# EAGLE design midihub (EAGLE 5.10)
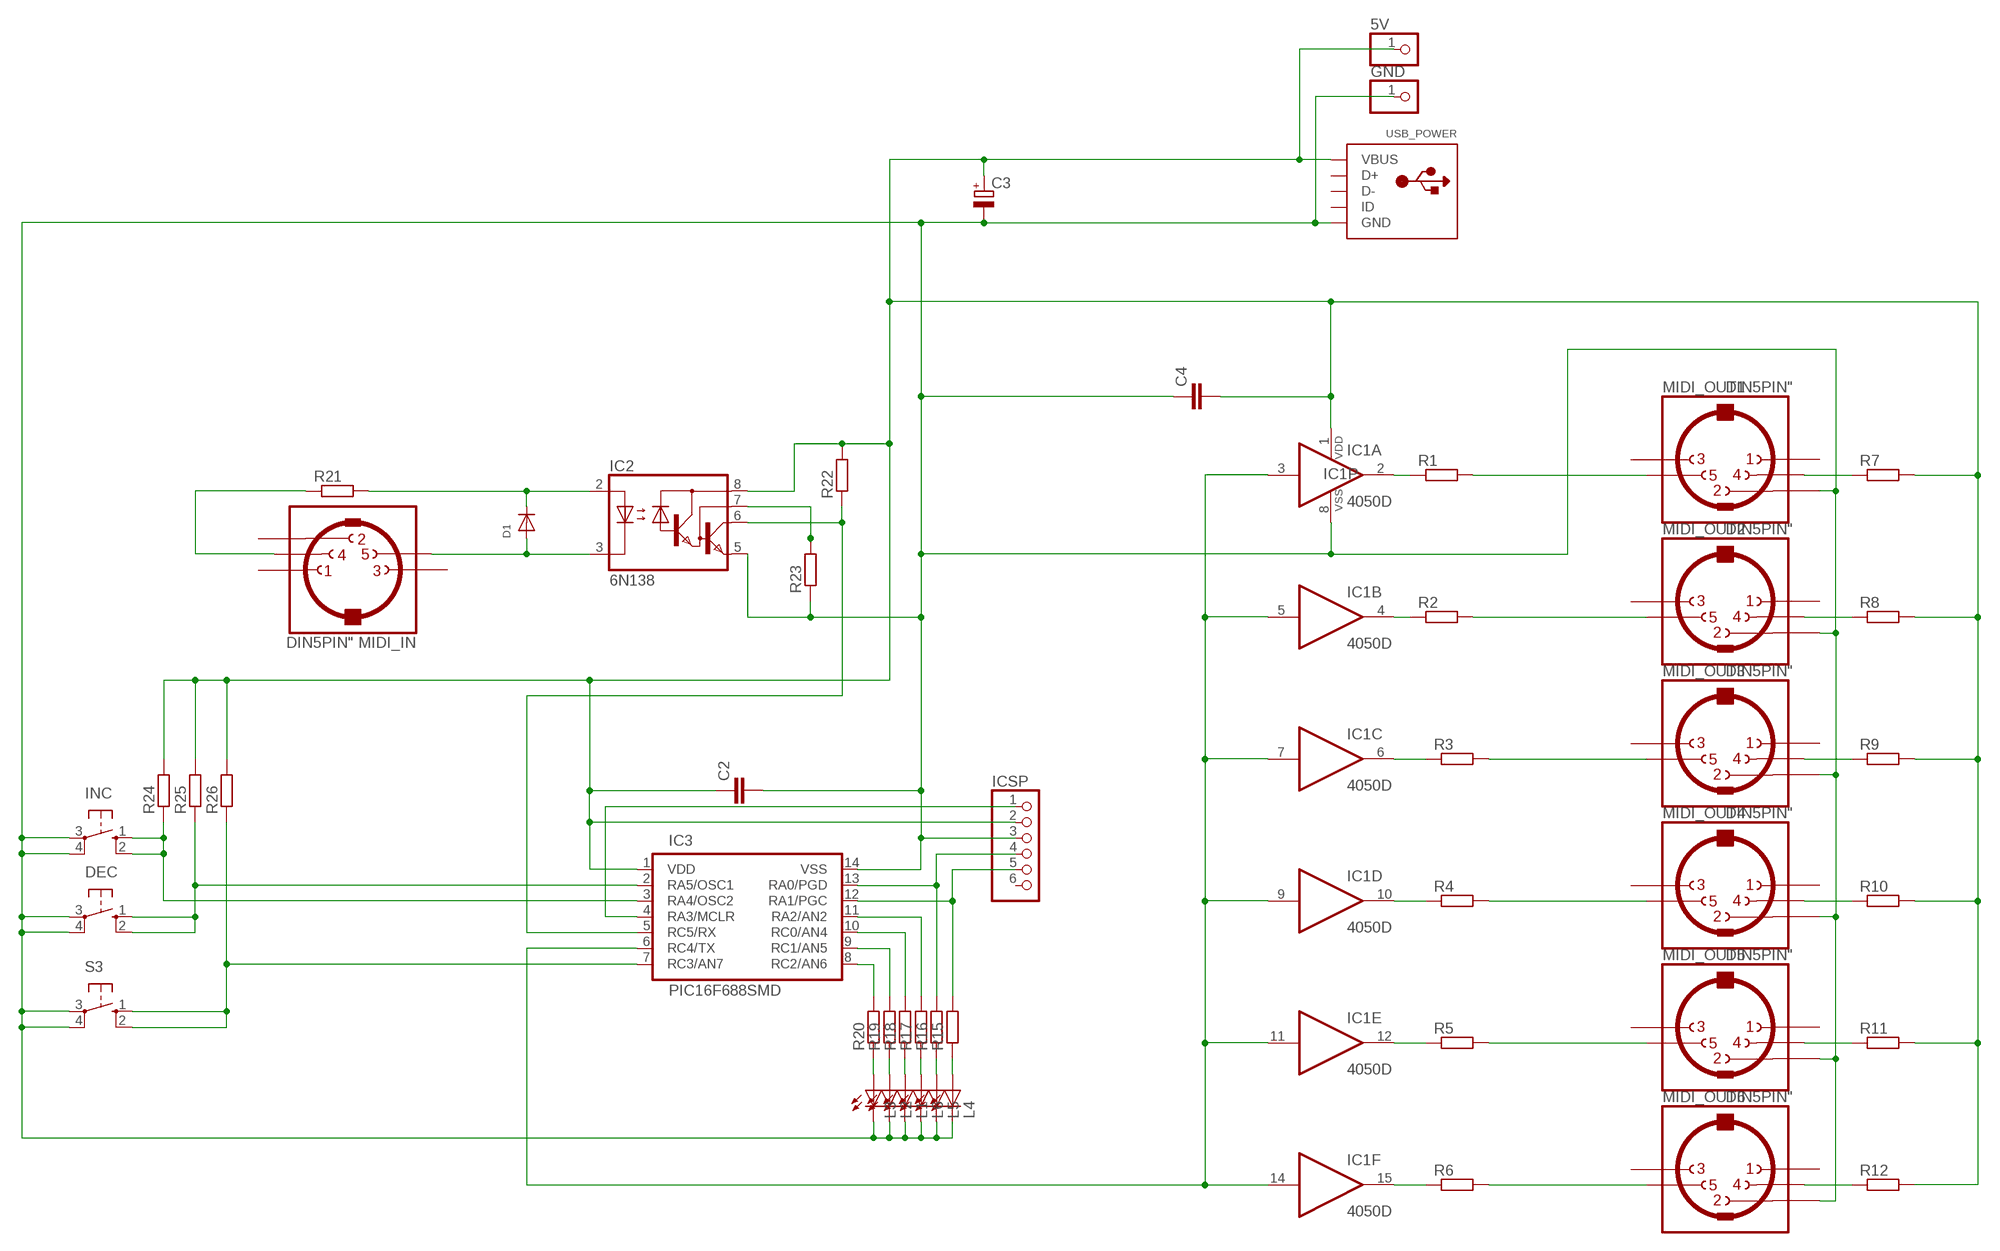
[diagram p0: schematic, sheet 1]

## Parts
5V  PINHD-1X1  [1X01]
C2  C-EUC0805  [C0805]
C3  CPOL-EUSMCB  [SMC_B]
C4  C-EUC0805  [C0805]
D1  DIODESOD-123  [SOD-123]
DEC  40-XX  [B3F-40XX-NOTAB]
GND  PINHD-1X1  [1X01]
IC1  4050D  [SO16]
IC2  6N138  [DIL08]
IC3  PIC16F688SMD  [SOIC-14]
ICSP  PINHD-1X6  [1X06]
INC  40-XX  [B3F-40XX-NOTAB]
L1  LED3MM  [LED3MM]
L2  LED3MM  [LED3MM]
L3  LED3MM  [LED3MM]
L4  LED3MM  [LED3MM]
L5  LED3MM  [LED3MM]
L6  LED3MM  [LED3MM]
MIDI_IN  DIN5PIN"  [TRUCONN90]
MIDI_OUT1  DIN5PIN"  [TRUCONN90]
MIDI_OUT2  DIN5PIN"  [TRUCONN90]
MIDI_OUT3  DIN5PIN"  [TRUCONN90]
MIDI_OUT4  DIN5PIN"  [TRUCONN90]
MIDI_OUT5  DIN5PIN"  [TRUCONN90]
MIDI_OUT6  DIN5PIN"  [TRUCONN90]
R1  R-EU_R0805  [R0805]
R2  R-EU_R0805  [R0805]
R3  R-EU_R0805  [R0805]
R4  R-EU_R0805  [R0805]
R5  R-EU_R0805  [R0805]
R6  R-EU_R0805  [R0805]
R7  R-EU_R0805  [R0805]
R8  R-EU_R0805  [R0805]
R9  R-EU_R0805  [R0805]
R10  R-EU_R0805  [R0805]
R11  R-EU_R0805  [R0805]
R12  R-EU_R0805  [R0805]
R15  R-EU_R0805  [R0805]
R16  R-EU_R0805  [R0805]
R17  R-EU_R0805  [R0805]
R18  R-EU_R0805  [R0805]
R19  R-EU_R0805  [R0805]
R20  R-EU_R0805  [R0805]
R21  R-EU_R0805  [R0805]
R22  R-EU_R0805  [R0805]
R23  R-EU_R0805  [R0805]
R24  R-EU_R0805  [R0805]
R25  R-EU_R0805  [R0805]
R26  R-EU_R0805  [R0805]
S3  40-XX  [B3F-40XX-NOTAB]
USB_POWER  USBTHM  [USB-MINIB-THM]

## Nets
GND: C2.2 C3.- C4.1 DEC.3(P) DEC.4(P1) GND.1 IC1.8(P:VSS) IC2.5(GND) IC3.14(VSS) ICSP.3 INC.3(P) INC.4(P1) L1.K(C) L2.K(C) L3.K(C) L4.K(C) L5.K(C) L6.K(C) MIDI_OUT1.2 MIDI_OUT2.2 MIDI_OUT3.2 MIDI_OUT4.2 MIDI_OUT5.2 MIDI_OUT6.2 R23.1 S3.3(P) S3.4(P1) USB_POWER.GND
N$1: IC1.2(A:O) R1.1
N$2: IC1.4(B:O) R2.1
N$3: IC1.6(C:O) R3.1
N$4: IC1.10(D:O) R4.1
N$5: IC1.12(E:O) R5.1
N$6: IC1.15(F:O) R6.1
N$7: MIDI_OUT1.5 R1.2
N$8: MIDI_OUT2.5 R2.2
N$9: MIDI_OUT3.5 R3.2
N$10: MIDI_OUT4.5 R4.2
N$11: MIDI_OUT5.5 R5.2
N$12: MIDI_OUT6.5 R6.2
N$13: MIDI_OUT1.4 R7.1
N$14: MIDI_OUT2.4 R8.1
N$15: MIDI_OUT3.4 R9.1
N$16: MIDI_OUT4.4 R10.1
N$17: MIDI_OUT5.4 R11.1
N$18: MIDI_OUT6.4 R12.1
N$19: IC3.13(RA0/PGD) ICSP.4 R16.2
N$20: IC3.3(RA4/OSC2) INC.1(S) INC.2(S1) R24.1
N$21: DEC.1(S) DEC.2(S1) IC3.2(RA5/OSC1) R25.1
N$22: L3.A R20.1
N$23: L2.A R19.1
N$24: L1.A R18.1
N$25: L6.A R17.1
N$26: L5.A R16.1
N$27: L4.A R15.1
N$28: IC3.8(RC2/AN6) R20.2
N$29: IC3.9(RC1/AN5) R19.2
N$30: IC3.10(RC0/AN4) R18.2
N$31: IC3.11(RA2/AN2) R17.2
N$32: IC3.7(RC3/AN7) R26.1 S3.1(S) S3.2(S1)
N$36: IC1.3(A:I) IC1.5(B:I) IC1.7(C:I) IC1.9(D:I) IC1.11(E:I) IC1.14(F:I) IC3.6(RC4/TX)
N$38: IC3.12(RA1/PGC) ICSP.5 R15.2
N$41: D1.A IC2.3(C) MIDI_IN.5
N$42: MIDI_IN.4 R21.1
N$43: D1.C IC2.2(A) R21.2
N$44: IC3.4(RA3/MCLR) ICSP.1
N$45: IC2.6(VO) IC3.5(RC5/RX) R22.1
N$46: IC2.7(VB) R23.2
VDD: 5V.1 C2.1 C3.+ C4.2 IC1.1(P:VDD) IC2.8(VCC) IC3.1(VDD) ICSP.2 R7.2 R8.2 R9.2 R10.2 R11.2 R12.2 R22.2 R24.2 R25.2 R26.2 USB_POWER.VBUS
Unconnected: ICSP.6 MIDI_IN.1 MIDI_IN.2 MIDI_IN.3 MIDI_OUT1.1 MIDI_OUT1.3 MIDI_OUT2.1 MIDI_OUT2.3 MIDI_OUT3.1 MIDI_OUT3.3 MIDI_OUT4.1 MIDI_OUT4.3 MIDI_OUT5.1 MIDI_OUT5.3 MIDI_OUT6.1 MIDI_OUT6.3 USB_POWER.D+ USB_POWER.D- USB_POWER.ID

## Library data of the parts
5V GND = pinhead:PINHD-1X1: PIN HEADER
C2 C4 = rcl:C-EU: CAPACITOR, European symbol
C3 = rcl:CPOL-EU: POLARIZED CAPACITOR, European symbol
D1 = adafruit:DIODE: Diode SMADIODE - SMA Surface Mount Package 20V 1A Schottky Diode Digikey: 641-1014-6-ND DO-1N4148 - Through Hole Small Current Diode SOD-123 20V 1 A (.5mV Vf) Schottky Diode - Digikey: MBRX120TPMSCT-ND SOD-323 10V 570mA (.38mV Vf, 3ns) Schottky Diode - Digikey: ZLLS410CT-ND SOD-523 30V 30mA Schottky Diode (RB751S-40TE61) - Digikey: RB751S-40TE61CT-ND SOT23-R/W - SOT23 Package (R = Solder Paste/Reflow Ovens, W = Hand-Soldering) BAT54Film 40V 300mA - Digikey: 497-7162-1-ND
DEC INC S3 = jasons_stuff:40-XX: OMRON SWITCH
IC1 = 40xx:4050: Hex non-inverting BUFFER
IC2 = optocoupler:6N138: MOTOROLA OPTO COUPLER
IC3 = SparkFun:PIC16F688: PIC 16F688 8-Bit PIC16F88
ICSP = adafruit:PINHD-1X6: PIN HEADER
L1-L6 = SparkFun:LED: LEDs Standard schematic elements and footprints for 5mm, 3mm, 1206, and 0603 sized LEDs. 5mm - Spark Fun Electronics SKU : COM-00529 (and others)
MIDI_IN MIDI_OUT1-MIDI_OUT6 = jasons_stuff:DIN5PIN: Female CONNECTOR 5 pins 90 deg. with shield, horizontal (DIN 41524)
R1-R12 R15-R26 = rcl:R-EU_: RESISTOR, European symbol
USB_POWER = adafruit:USB: USB Connectors USBMINIB - Surface Mount Female Mini-B USB Connector 4UConnector: 06564 By microbuilder.eu Thru-hole RA Female Mini-B USB Connector 4UConnector: 18732 By ladyada.net

## Board
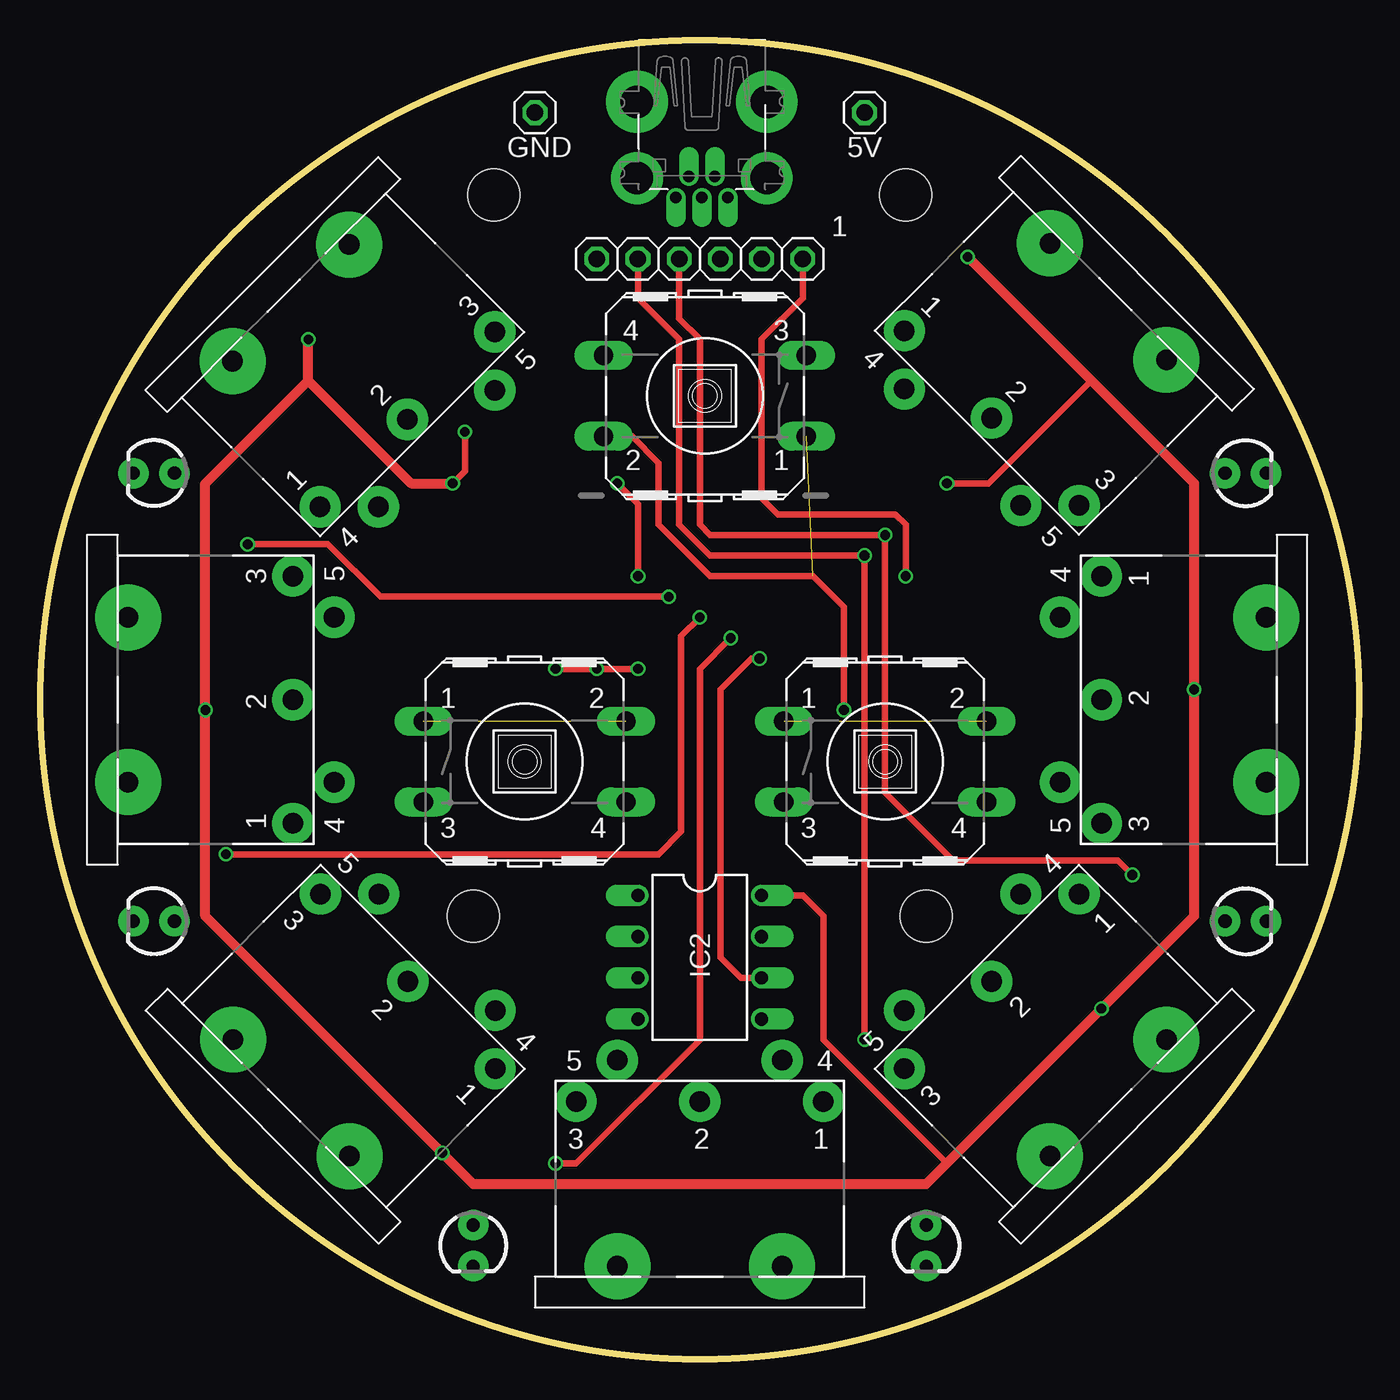
[diagram p1: board, top side]
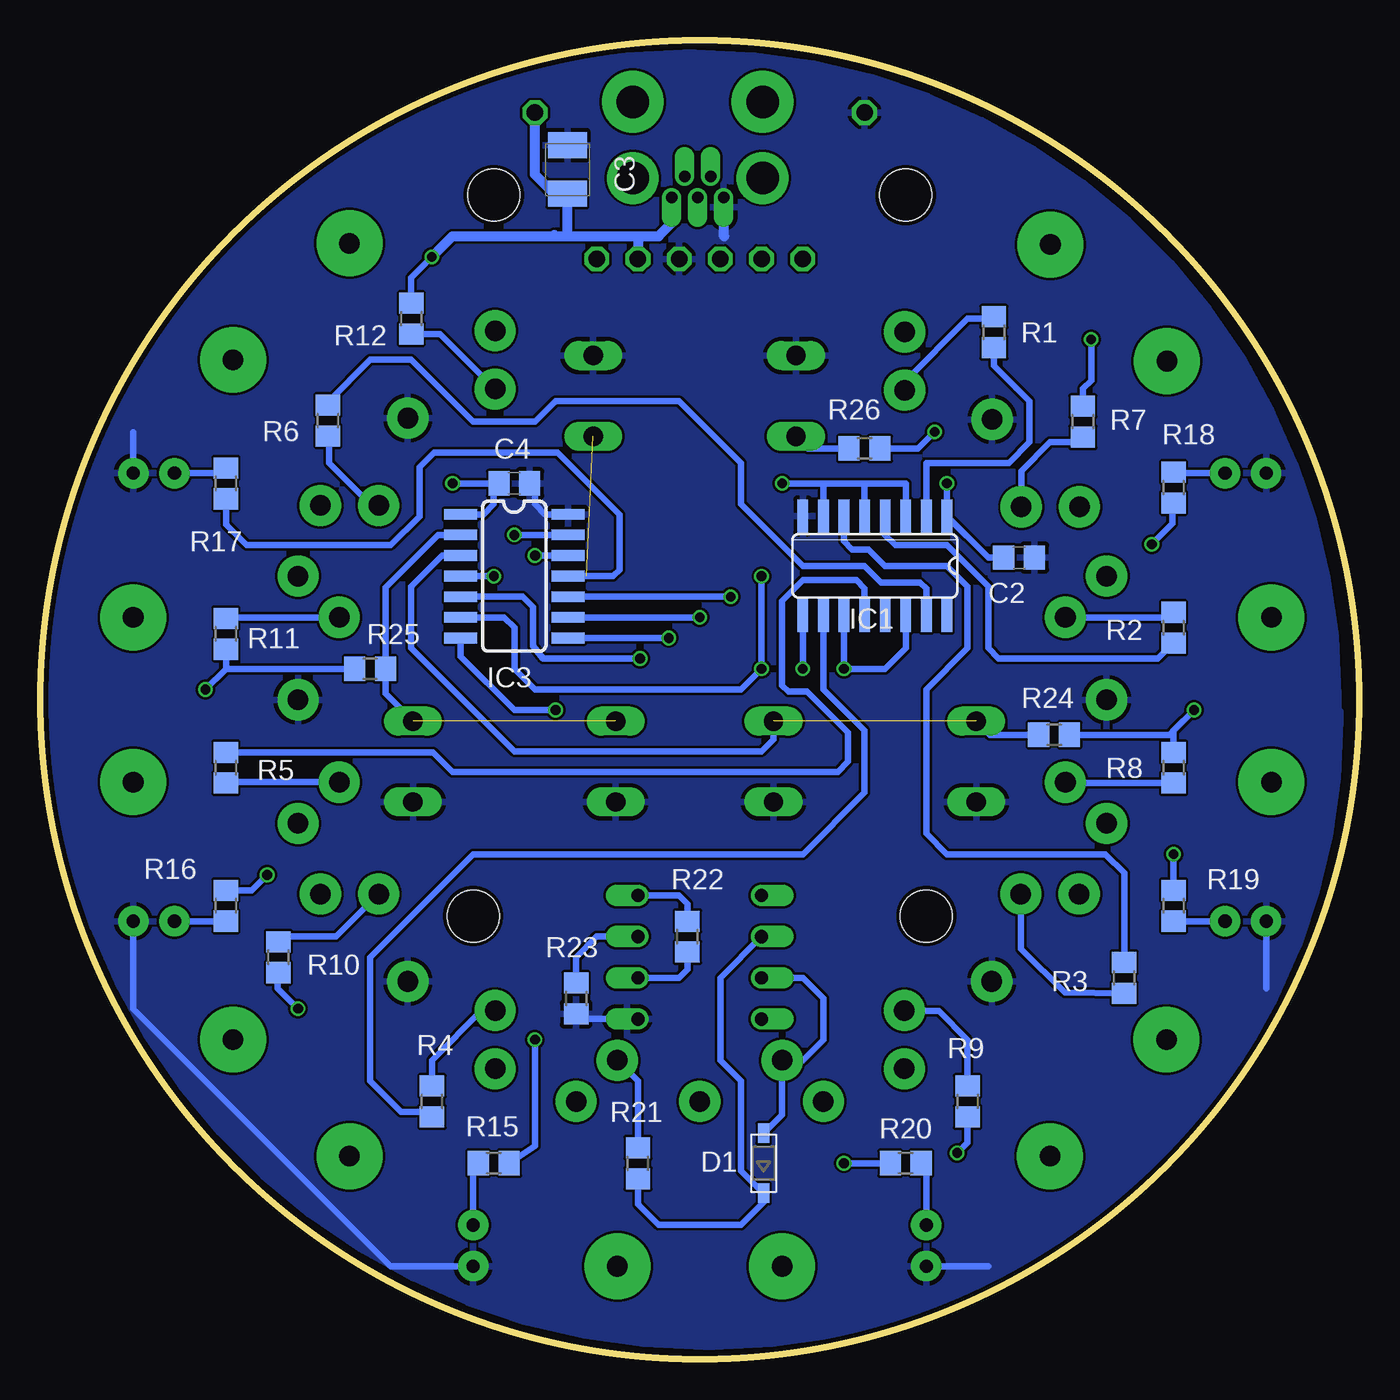
[diagram p2: board, bottom side, seen from below]

Size 81.28 x 81.28 mm. Coordinates in mm from the lower left corner, seen from the top.
Outline: circle at 40.64,40.64 radius 40.64
Copper layers (1*16): Top 0.035mm / dielectric 1.5mm / Bottom 0.035mm
Design rules "ITEADstudio_DRC": minimum track width 6mil, minimum drill 12mil, track to track 6mil, track to pad 6mil, pad to pad 6mil, via to via 6mil, smd to smd 0mil, copper to edge 10mil, drill to drill 10mil, minimum pad ring 10mil, minimum via ring 6mil, stop-mask expansion 2mil, vias tented up to drill 100mil, thermal gap 10mil
Holes 3.2 mm at 26.67,27.3 54.61,27.3 27.94,71.75 53.34,71.75

### Footprints (pad centres in the part's own frame; a part is rotated, then mirrored left to right if it is on the bottom)
1X01 = drill 1.016 octagon: 1 0,0
C0805 = smd 1.3 x 1.5: 1 -0.95,0; 2 0.95,0
SMC_B = smd 1.6 x 2.4: + -1.5,0; - 1.5,0
SOD-123 = smd 1.2 x 0.7: A 1.85,0; C -1.85,0
B3F-40XX-NOTAB = drill 1.194 long: 1 -6.248,2.489; 2 6.248,2.489; 3 -6.248,-2.489; 4 6.248,-2.489
SO16 = smd 0.66 x 2.032: 1 -4.445,-3.073; 2 -3.175,-3.073; 3 -1.905,-3.073; 4 -0.635,-3.073; 5 0.635,-3.073; 6 1.905,-3.073; 7 3.175,-3.073; 8 4.445,-3.073; 9 4.445,3.073; 10 3.175,3.073; 11 1.905,3.073; 12 0.635,3.073; 13 -0.635,3.073; 14 -1.905,3.073; 15 -3.175,3.073; 16 -4.445,3.073
DIL08 = drill 0.813 offset: 1 -3.81,-3.81; 2 -1.27,-3.81; 3 1.27,-3.81; 4 3.81,-3.81; 5 3.81,3.81; 6 1.27,3.81; 7 -1.27,3.81; 8 -3.81,3.81
SOIC-14 = smd 0.66 x 2.032: 1 -4.445,-3.315; 2 -3.175,-3.315; 3 -1.905,-3.315; 4 -0.635,-3.315; 5 0.635,-3.315; 6 1.905,-3.315; 7 3.175,-3.315; 8 3.175,3.315; 9 1.905,3.315; 10 0.635,3.315; 11 -0.635,3.315; 12 -1.905,3.315; 13 -3.175,3.315; 14 -4.445,3.315
1X06 = drill 1.016 octagon: 1 -6.35,0; 2 -3.81,0; 3 -1.27,0; 4 1.27,0; 5 3.81,0; 6 6.35,0
LED3MM = drill 0.813 pad 1.88 round: A -1.27,0; K 1.27,0
TRUCONN90 = drill 1.27 pad 2.54 round: 1 7.62,5.08; 2 0,5.08; 3 -7.62,5.08; 4 5.08,7.62; 5 -5.08,7.62 | drill 1.27 pad 4.064 round: NC -5.08,-5.08; NC@ 5.08,-5.08
R0805 = smd 1.3 x 1.5: 1 -0.95,0; 2 0.95,0
USB-MINIB-THM = drill 0.7 offset: D+ 0,9.8; D- -0.8,8.5; GND 1.6,9.8; ID 0.8,8.5; VBUS -1.6,9.8 | drill 2 pad 3.81 round: GND1 -4,3.9; GND4 4,3.9 | drill 2 pad 3.2 round: GND2 -4,8.6; GND3 4,8.6

### Placement (x,y rotation side)
5V  50.8,76.84 0 top
C2  20.96,49.4 0 bottom
C3  48.79,73.33 90 bottom
C4  52.07,53.98 180 bottom
D1  36.7,12.06 90 bottom
DEC  52.07,36.83 0 top
GND  30.48,76.84 0 top
IC1  29.85,48.89 180 bottom
IC2  40.64,24.76 270 top
IC3  52.07,47.62 270 bottom
ICSP  40.64,67.82 180 top
INC  29.85,36.83 0 top
L1  6.99,54.61 180 top
L2  6.99,26.99 180 top
L3  26.67,6.98 270 top
L4  54.61,6.98 270 top
L5  74.3,26.99 0 top
L6  74.3,54.61 0 top
MIDI_IN  40.64,10.79 0 top
MIDI_OUT1  19.02,61.52 225 top
MIDI_OUT2  10.48,40.64 270 top
MIDI_OUT3  19.05,19.68 315 top
MIDI_OUT4  62.23,19.68 45 top
MIDI_OUT5  70.48,40.64 90 top
MIDI_OUT6  62.23,61.59 135 top
R1  22.5,63.3 90 bottom
R2  11.43,45.09 90 bottom
R3  14.48,23.49 270 bottom
R4  57.15,15.87 90 bottom
R5  69.85,36.45 270 bottom
R6  63.56,57.85 270 bottom
R7  17.02,57.78 90 bottom
R8  11.43,36.45 90 bottom
R9  24.13,15.87 270 bottom
R10  66.61,24.76 270 bottom
R11  69.85,44.7 270 bottom
R12  58.42,64.13 90 bottom
R15  53.34,12.06 0 bottom
R16  69.85,27.94 90 bottom
R17  69.85,53.98 270 bottom
R18  11.43,53.72 270 bottom
R19  11.43,27.94 90 bottom
R20  27.94,12.06 180 bottom
R21  44.45,12.06 270 bottom
R22  41.4,26.03 90 bottom
R23  48.26,22.22 90 bottom
R24  18.8,38.48 0 bottom
R25  60.96,42.54 180 bottom
R26  30.48,56.13 0 bottom
S3  40.96,59.37 180 top
USB_POWER  40.77,81.41 180 top

### Tracks (layer width: path | path; a pad name or v marks a point on that pad's centre or on a via)
GND
  Bottom 0.406: IC2.5 47.94,20.95 R23.1 | IC3.14 50.17,52.07 50.8,52.7 50.8,53.66 C4.1 | 5.72,22.86 L2.K | 22.86,5.71 L3.K | L4.K 59.69,5.71 75.56,21.59 L5.K | L6.K 75.56,57.15
  Bottom 0.61: USB_POWER.GND 39.17,69.27 39.12,69.22
  pour Bottom: 1.27,40 1.27,40.89 arc-90 40.89,80.52 41.66,80.52 arc-90 80.77,41.4 80.77,41.15 arc-90 40.39,0.76 39.75,0.76 arc-90 1.14,39.37 1.14,39.88 arc-90
N$1
  Bottom 0.406: R1.1 22.5,61.24 20.32,59.05 20.32,56.52 21.59,55.24 26.67,55.24 IC1.2
N$2
  Bottom 0.406: IC1.4 29.21,50.8 28.58,50.16 25.4,50.16 22.86,47.62 22.86,43.81 22.23,43.18 12.39,43.18 R2.1
N$3
  Bottom 0.406: IC1.6 31.75,50.42 31.24,49.91 30.23,49.91 29.21,48.89 25.4,48.89 24.13,47.62 24.13,43.81 26.67,41.27 26.67,32.38 25.4,31.11 15.62,31.11 14.48,29.97 R3.1
N$4
  Bottom 0.406: IC1.10 33.02,41.27 30.48,38.73 30.48,34.92 34.29,31.11 54.61,31.11 60.96,24.76 60.96,17.14 59.06,15.24 57.47,15.24 R4.1
N$5
  Bottom 0.406: IC1.12 30.48,47.5 30.99,48.01 34.29,48.01 35.56,46.74 35.56,41.53 35.18,41.15 34.04,41.15 31.5,38.61 31.5,36.83 32.13,36.2 55.88,36.2 57.08,37.4 R5.1
N$6
  Bottom 0.406: R6.1 63.56,58.99 60.96,61.59 58.42,61.59 54.61,57.78 50.8,57.78 49.53,59.05 41.91,59.05 38.1,55.24 38.1,52.7 34.29,48.89 30.48,48.89 29.46,47.88 27.05,47.88 26.67,47.5 IC1.15
N$7
  Bottom 0.406: MIDI_OUT1.5 28.01,60.26 24.13,64.13 22.62,64.13 R1.2
N$8
  Bottom 0.406: MIDI_OUT2.5 11.75,45.72 R2.2
N$9
  Bottom 0.406: MIDI_OUT3.5 20.85,25.29 18.14,22.58 R3.2
N$10
  Bottom 0.406: MIDI_OUT4.5 54.08,21.48 57.15,18.41 R4.2
N$11
  Bottom 0.406: MIDI_OUT5.5 69.79,35.56 R5.2
N$12
  Bottom 0.406: MIDI_OUT6.5 60.87,52.61 63.5,55.24 63.5,56.84 R6.2
N$13
  Bottom 0.406: MIDI_OUT1.4 20.82,54.74 19.05,56.52 17.34,56.52 R7.1
N$14
  Bottom 0.406: R8.1 18.04,35.5 MIDI_OUT2.4
N$15
  Bottom 0.406: R9.1 24.13,19.68 25.91,21.46 28.01,21.46 MIDI_OUT3.4
N$16
  Bottom 0.406: R10.1 66.29,26.03 63.06,26.03 MIDI_OUT4.4
N$17
  Bottom 0.406: MIDI_OUT5.4 69.78,45.72 R11.1
N$18
  Bottom 0.406: MIDI_OUT6.4 56.64,63.18 R12.1
N$19  (via drill 0.6)
  Top 0.406: v67.31,29.84 66.42,30.73 56.26,30.73 52.07,34.92 v52.07,50.8 41.28,50.8 40.64,51.43 40.64,62.86 39.37,64.13 ICSP.4
  Bottom 0.406: R16.2 68.27,28.89 v67.31,29.84 | v52.07,50.8 IC3.13
N$20  (1 unrouted)
  Bottom 0.406: IC3.3 56.52,49.53 58.42,47.62 58.42,43.81 52.07,37.46 36.83,37.46 36.09,38.2 INC.2 | R24.1 22.76,38.48 INC.1
N$21  (1 unrouted)
  Bottom 0.406: IC3.2 56.77,50.8 60.01,47.56 R25.1 60.01,41.01 DEC.2
N$22
  Bottom 0.406: L3.A 26.67,11.74 R20.1
N$23
  Bottom 0.406: L2.A R19.1
N$24
  Bottom 0.406: L1.A 11.37,54.61 R18.1
N$25
  Bottom 0.406: L6.A 70.17,54.61 R17.1
N$26
  Bottom 0.406: L5.A R16.1
N$27
  Bottom 0.406: L4.A 54.61,11.74 R15.1
N$28  (via drill 0.6)
  Top 0.406: v31.75,12.06 33.02,12.06 40.64,19.68 40.64,42.54 v42.55,44.45
  Bottom 0.406: v42.55,44.45 IC3.8 | R20.2 v31.75,12.06
N$29  (via drill 0.6)
  Top 0.406: v11.43,31.11 38.1,31.11 39.5,32.51 39.5,44.58 v40.64,45.72 40.39,45.72
  Bottom 0.406: v40.64,45.72 IC3.9 | R19.2 v11.43,31.11
N$30  (via drill 0.6)
  Top 0.406: v12.77,50.23 17.71,50.23 20.96,46.99 v38.74,46.99
  Bottom 0.406: v38.74,46.99 IC3.10 | R18.2 11.5,52.7 11.5,51.5 v12.77,50.23
N$31
  Bottom 0.406: R17.2 69.85,51.43 68.58,50.16 59.69,50.16 57.91,51.94 57.91,54.99 57.02,55.88 49.4,55.88 45.59,52.07 45.59,48.64 45.97,48.26 IC3.11
N$32  (via drill 0.6)  (1 unrouted)
  Top 0.406: S3.2 36.46,56.88 38.1,55.24 38.1,51.43 41.28,48.26 47.62,48.26 49.53,46.35 v49.53,40
  Bottom 0.406: IC3.7 55.39,43.32 52.07,40 v49.53,40 | R26.1 33.96,56.13 S3.2
N$36  (via drill 0.6)
  Top 0.406: v31.75,42.54 v34.29,42.54 v36.83,42.54 | v36.83,48.26 36.83,52.7 v35.56,53.98
  Bottom 0.406: IC1.11 v31.75,42.54 29.21,42.54 27.94,43.81 IC1.14 | v34.29,42.54 IC1.9 | IC3.6 52.71,45.72 52.07,45.09 52.07,42.54 50.8,41.27 38.1,41.27 v36.83,42.54 v36.83,48.26 | IC1.3 27.94,53.98 30.48,53.98 | 33.02,53.98 IC1.7 | 33.02,53.98 30.48,53.98 | 30.48,53.98 IC1.5 | v35.56,53.98 33.02,53.98
N$38  (via drill 0.6)
  Top 0.406: v50.8,19.68 v50.8,49.53 41.28,49.53 39.37,51.43 39.37,62.86 36.83,65.41 ICSP.5
  Bottom 0.406: v50.8,19.68 50.8,13.15 R15.2 | v50.8,49.53 IC3.12
N$41
  Bottom 0.406: IC2.3 34.29,23.49 33.02,22.22 33.02,19.68 34.29,18.41 MIDI_IN.5 35.56,15.06 D1.A
N$42
  Bottom 0.406: R21.1 44.45,17.14 MIDI_IN.4
N$43
  Bottom 0.406: IC2.2 39.37,23.49 39.37,18.41 38.1,17.14 38.1,11.61 D1.C 36.7,9.65 38.1,8.25 43.18,8.25 44.45,9.52 R21.2
N$44  (via drill 0.6)
  Top 0.406: v53.34,48.26 53.34,51.43 52.71,52.07 45.47,52.07 44.45,53.09 44.45,62.86 46.99,65.41 ICSP.1
  Bottom 0.406: v53.34,48.26 IC3.4
N$45  (via drill 0.6)
  Top 0.406: IC2.6 43.18,23.49 41.91,24.76 41.91,41.27 43.82,43.18 v44.32,43.18
  Bottom 0.406: R22.1 41.4,24 41.91,23.49 IC2.6 | v44.32,43.18 50.29,43.18 50.93,43.94 50.93,46.35 51.56,46.99 IC3.5
N$46
  Bottom 0.406: IC2.7 46.99,26.03 48.26,24.76 R23.2
VDD  (via drill 0.6)
  Top 0.406: v55.88,53.98 58.42,53.98 64.77,60.32 | IC2.8 46.99,28.57 48.26,27.3 48.26,19.68 55.88,12.06 | v26.16,57.15 26.16,54.74 v25.4,53.98
  Top 0.61: v57.15,67.94 64.77,60.32 71.12,53.98 v71.12,41.27 71.12,27.3 v65.41,21.59 55.88,12.06 54.61,10.79 26.67,10.79 v24.77,12.7 10.16,27.3 v10.16,40 10.16,53.98 16.51,60.32 | v25.4,53.98 22.86,53.98 16.51,60.32 | 16.51,60.32 v16.51,62.86
  Bottom 0.406: R22.2 41.4,28.07 41.91,28.57 IC2.8 | IC3.1 53.98,52.07 53.34,52.7 53.34,53.66 C4.2 v55.88,53.98 | 11.36,37.46 R8.2 11.43,38.73 v10.16,40 11.68,38.48 R24.2 | R12.2 58.42,66.68 v57.15,67.94 | 69.85,42.54 R11.2 | v71.12,41.27 69.85,42.54 | IC1.1 22.84,49.4 C2.1 22.86,49.4 25.4,51.94 v25.4,53.98 | 69.85,42.54 R25.2 | R26.2 27.18,56.13 v26.16,57.15 | R7.2 17.02,59.82 16.51,60.32 v16.51,62.86 | R10.2 66.67,23.75 66.67,22.86 v65.41,21.59 | R9.2 24.13,13.33 v24.77,12.7
  Bottom 0.61: 44.45,69.22 ICSP.2 | USB_POWER.VBUS 42.37,70.03 43.18,69.22 44.45,69.22 | 49.53,69.22 55.88,69.22 v57.15,67.94 | 49.53,69.22 48.77,69.22 | 48.77,69.22 44.45,69.22 | 49.53,69.22 49.62,69.31 | 48.77,69.22 48.79,69.24 C3.+ 48.87,71.75 49.53,71.75 50.8,73.03 5V.1

### Text on the board
tPlace: 1
tDocu: ++ | ++ | midi | midi | hub | hub | rev 4 | hotchk155